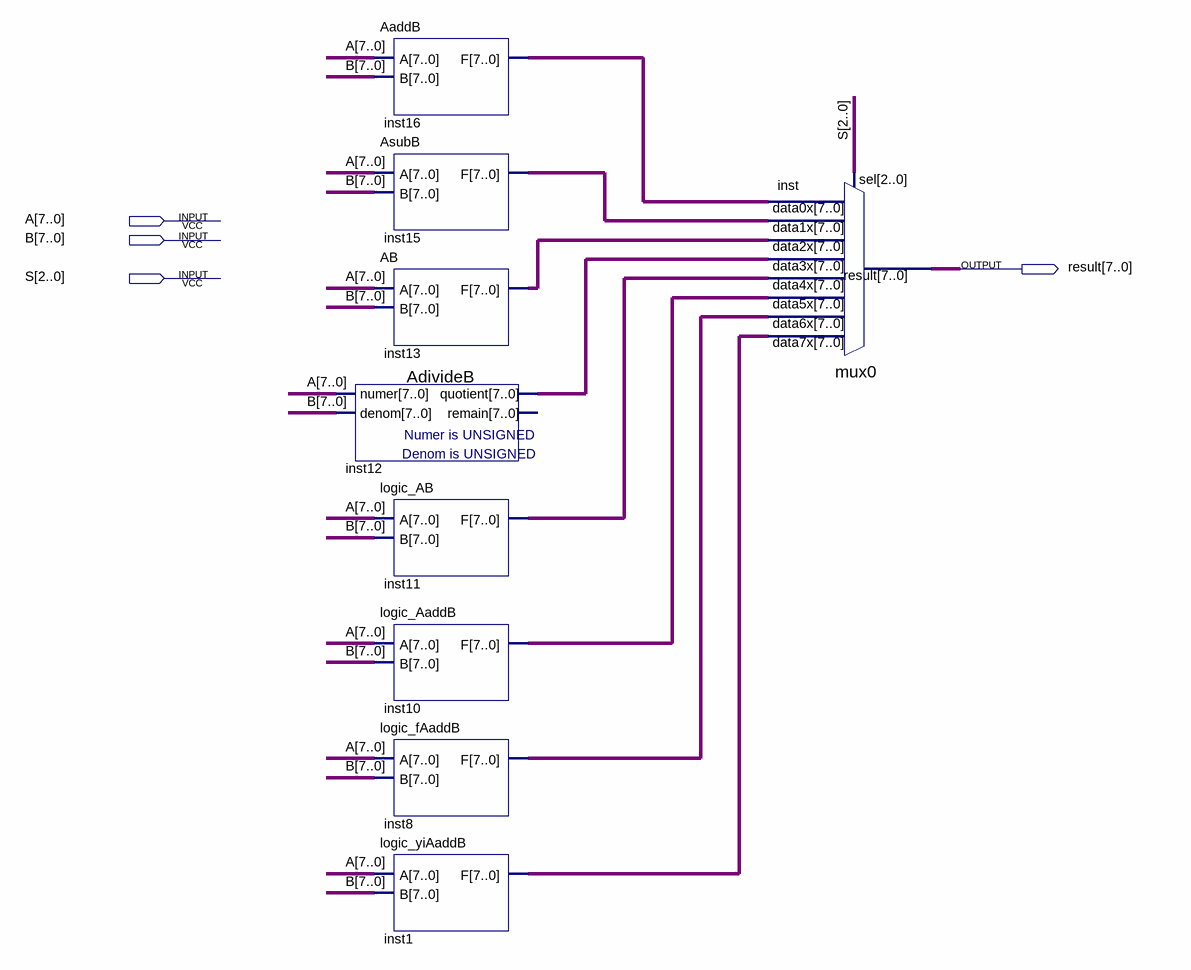
[diagram p0: schematic sheet]
// Quartus schematic 8choose1.bdf as structural Verilog: 9 symbols, 4 pins
module \8choose1  (
  input  [7:0] A,
  input  [7:0] B,
  input  [2:0] S,
  output [7:0] result
);

  wire [7:0] inst1_f, inst8_f, inst10_f, inst11_f, inst12_quotient, inst13_f, inst15_f, inst16_f;

  AaddB inst16 (.A(A), .B(B), .F(inst16_f));
  AsubB inst15 (.A(A), .B(B), .F(inst15_f));
  AB inst13 (.A(A), .B(B), .F(inst13_f));
  AdivideB inst12 (.numer(A), .denom(B), .quotient(inst12_quotient));  // open: remain
  logic_AB inst11 (.A(A), .B(B), .F(inst11_f));
  logic_AaddB inst10 (.A(A), .B(B), .F(inst10_f));
  logic_fAaddB inst8 (.A(A), .B(B), .F(inst8_f));
  logic_yiAaddB inst1 (.A(A), .B(B), .F(inst1_f));
  mux0 inst (
    .data7x(inst1_f), .data6x(inst8_f), .data5x(inst10_f), .data4x(inst11_f), .data3x(inst12_quotient),
    .data2x(inst13_f), .data1x(inst15_f), .data0x(inst16_f), .sel(S), .result(result));
endmodule
